# Altium schematic sheet Power.SchDoc
size A; SheetNumber: 6; SheetTotal: 8; SPICEModelCacheOOHVENGF: <root> / <DocumentId>OOHVENGF</DocumentId> / <CacheFrame Number="0"> / <Model Name="led0" Kind="MDL"> / <Text>*Typ INFRARED GaAs LED: Vf=1.2V Vr=5V If=40mA trr=3uS / *LED Pinout: 1=A, 2=K / .MODEL LED0 D (IS=93.5P RS=84M N=2.63 BV=5 IBV=10U / + CJO=2.97P VJ=.75 M=.333 TT=4.32U)</Text> / </Model> / <Model Name="diode" Kind="MDL"> / <Text>*Default Diode / *Diode Pinout: A,K / .MODEL DIODE D()</Text> / </Model> / </CacheFrame> / </root>
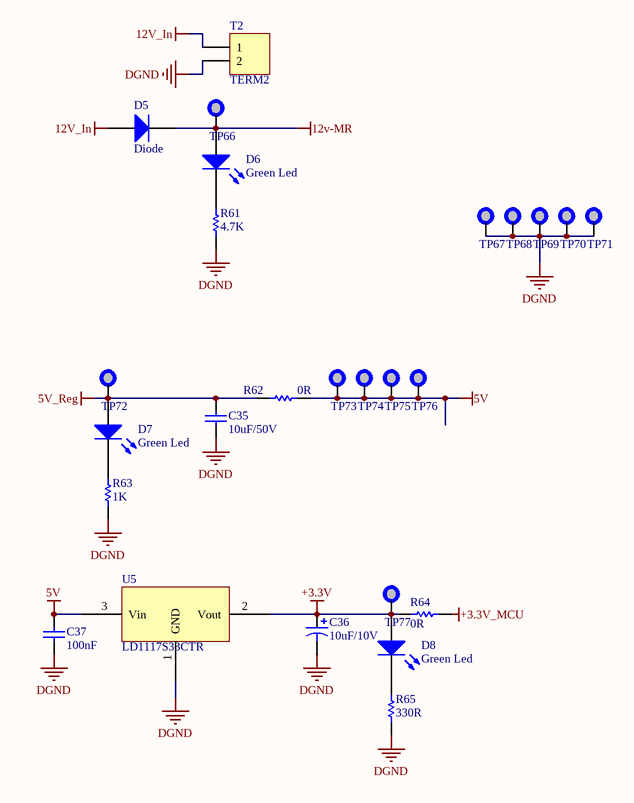
[diagram p0: Power.SchDoc]

## Parts
C35  value 10uF/50V  [1206C]  (hidden comment: CGA5L1X7R1H106K160AC)
C36  10uF/10V  [TAN-C-C]
C37  value 100nF  [0603C]  (hidden comment: CGA3E2X7R1H104K080AA)
D5  Diode  [SMC]
D6  Green Led  [0805LED]
D7  Green Led  [0805LED]
D8  Green Led  [0805LED]
R61  value 4.7K  [1206]  (hidden comment: Res1)
R62  value 0R  [1206]  (hidden comment: Res1)
R63  value 1K  [0805]  (hidden comment: Res1)
R64  value 0R  [1206]  (hidden comment: Res1)
R65  value 330R  [0805]  (hidden comment: Res1)
T2  TERM2  [term2]
TP66  TestPoint  [TP]  (value not drawn)
TP67  TestPoint  [TP]  (value not drawn)
TP68  TestPoint  [TP]  (value not drawn)
TP69  TestPoint  [TP]  (value not drawn)
TP70  TestPoint  [TP]  (value not drawn)
TP71  TestPoint  [TP]  (value not drawn)
TP72  TestPoint  [TP]  (value not drawn)
TP73  TestPoint  [TP]  (value not drawn)
TP74  TestPoint  [TP]  (value not drawn)
TP75  TestPoint  [TP]  (value not drawn)
TP76  TestPoint  [TP]  (value not drawn)
TP77  TestPoint  [TP]  (value not drawn)
U5  LD1117S33CTR  [sot223]

## Nets
5V: C37.1 R62.2 TP73.1 TP74.1 TP75.1 TP76.1 U5.3(Vin)
5V_Reg: C35.2 D7.1(A) R62.1 TP72.1
12v-MR: D5.2(K) D6.1(A) TP66.1
12V_In: D5.1(A) T2.1
+3.3V: C36.1 D8.1(A) R64.1 TP77.1 U5.2(Vout)
DGND: C35.1 C36.2 C37.2 R61.1 R63.1 R65.1 T2.2 TP67.1 TP68.1 TP69.1 TP70.1 TP71.1 U5.1(GND)
NetD6_2: D6.2(K) R61.2
NetD7_2: D7.2(K) R63.2
NetD8_2: D8.2(K) R65.2

Not connected (* = marked no-connect by the designer): R64 2

## Notes on the sheet
- Labels drawn without touching a wire or pin: +3.3V_MCU

## Library data of the parts
C35 C37 = Cap: Capacitor; Published: 8-Jun-2000; LatestRevisionDate: 17-Jul-2002; LatestRevisionNote: Re-released for DXP Platform.; PackageReference: RAD-0.3; Publisher: Altium Limited; PackageDescription: Radial Cap, Thru-Hole; 2 Leads; 0.3 in Pin Spacing
C36 = Cap Pol1: Tantalum; Value: 22uF; Published: 8-Jun-2000; LatestRevisionDate: 17-Jul-2002; LatestRevisionNote: Re-released for DXP Platform.; PackageReference: RB7.6-15; Publisher: Altium Limited; PackageDescription: Polarized Capacitor (Radial); 2 Leads
D5 = Diode: Default Diode; Value: 1N4007; Published: 8-Jun-2000; LatestRevisionDate: 17-Jul-2002; LatestRevisionNote: Re-released for DXP Platform.; PackageVersion: Sep-1996; PackageReference: SMC; Publisher: Altium Limited; PackageDescription: DO-214-AB/SMC; 2 C-Bend Leads; Body 7.9 x 5.9 mm, inc. leads (LxW); Code_JEDEC: DO-214-AB
D6-D8 = LED0: Typical INFRARED GaAs LED; Published: 8-Jun-2000; LatestRevisionDate: 08-Jul-2005; LatestRevisionNote: Mech Layer 1 removed.; PackageReference: LED-0; Publisher: Altium Limited; PackageDescription: LED; 2 Leads
R61-R65 = Res1: Resistor; Published: 8-Jun-2000; LatestRevisionDate: 17-Jul-2002; LatestRevisionNote: Re-released for DXP Platform.; PackageReference: AXIAL-0.3; Publisher: Altium Limited; PackageDescription: Axial Device, Thru-Hole; 2 Leads; 0.3 in Pin Spacing
T2 = Header 2: Header, 2-Pin; LatestRevisionDate: 17-Jul-2002; LatestRevisionNote: Re-released for DXP Platform.; Publisher: Altium Limited
U5 = AMS1117